# EAGLE design nor (EAGLE 9.6.2)
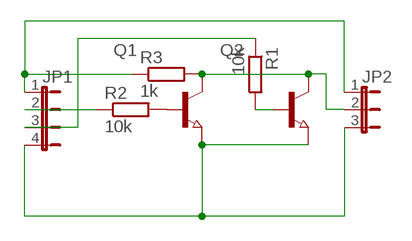
[diagram p0: schematic, sheet 1]

## Parts
JP1  JP4E  [JP4]
JP2  JP2W  [JP2W]
Q1  NPN-TRANSISTOR_SOT23  [SOT23]
Q2  NPN-TRANSISTOR_SOT23  [SOT23]
R1  10k  R-EU_R1206  [R1206]
R2  10k  R-EU_R1206  [R1206]
R3  1k  R-EU_R1206  [R1206]

## Nets
N$1: Q2.1(B) R1.2
N$2: Q1.1(B) R2.2
N$3: JP1.4 JP2.3 Q1.2(E) Q2.2(E)
N$5: JP2.2 Q1.3(C) Q2.3(C) R3.2
N$6: JP1.2 R2.1
N$7: JP1.3 R1.1
N$8: JP1.1 JP2.1 R3.1

## Library data of the parts
JP1 = jumper:JP4E: JUMPER
JP2 = jumper:JP2W: JUMPER
Q1 Q2 = semicon-smd-ipc:NPN-TRANSISTOR_: NPN TRANSISTOR
R1-R3 = rcl:R-EU_: RESISTOR, European symbol; SPICEPREFIX: R

## Net classes
0 default: width 1.27 mm

## Board
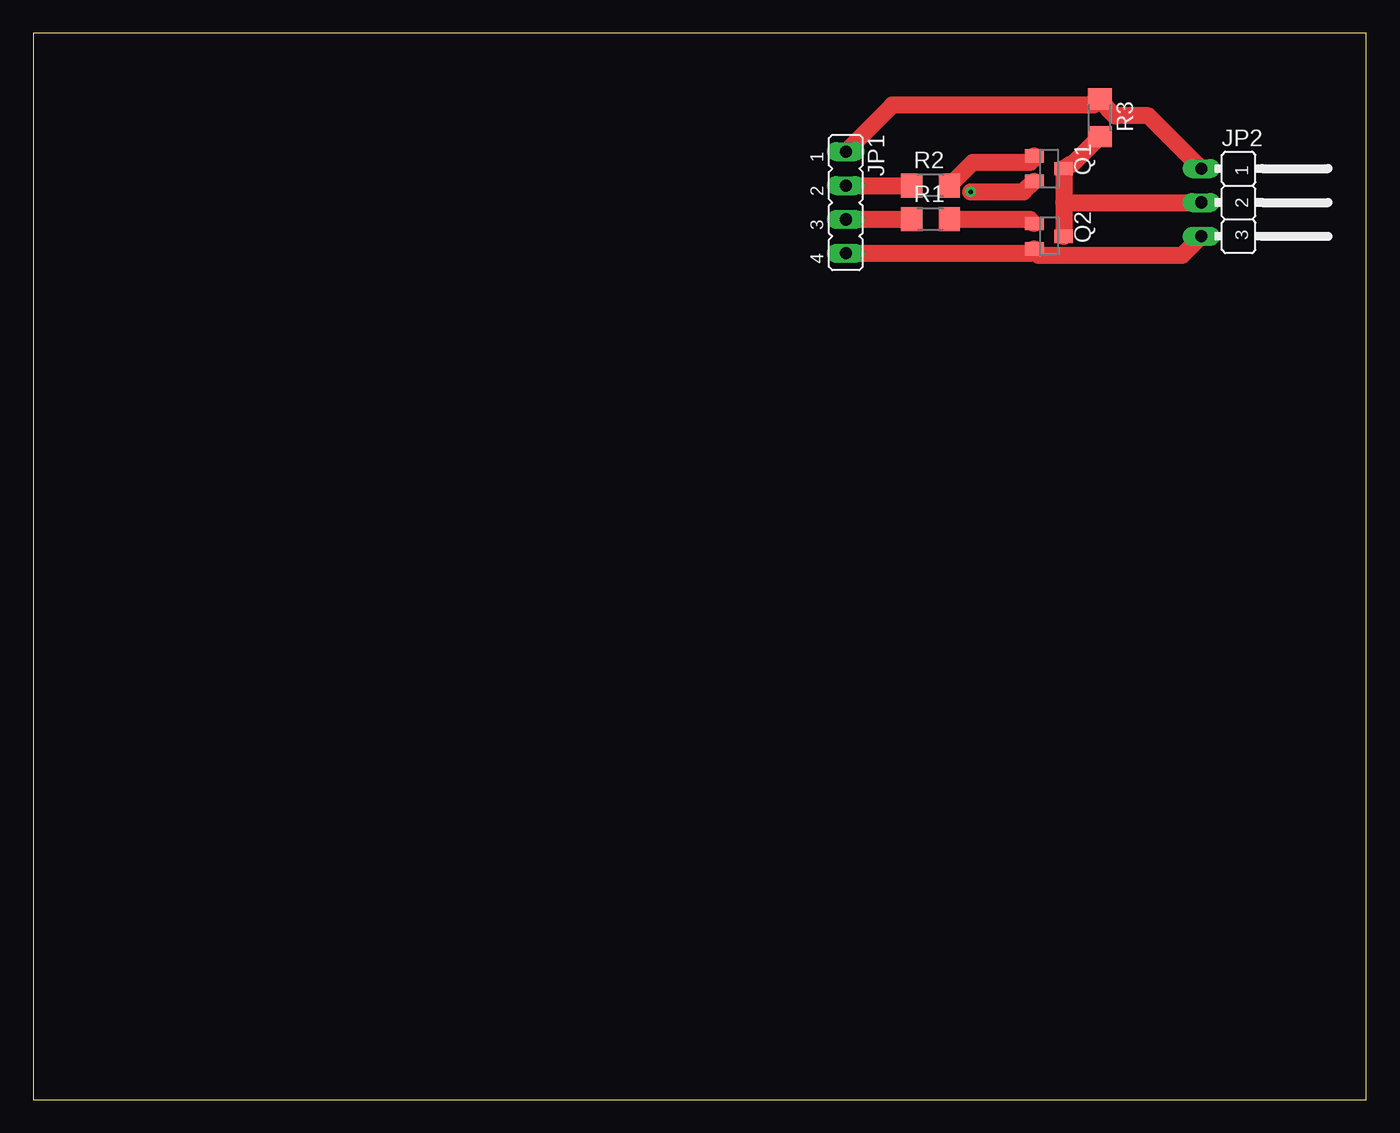
[diagram p1: board, top side]
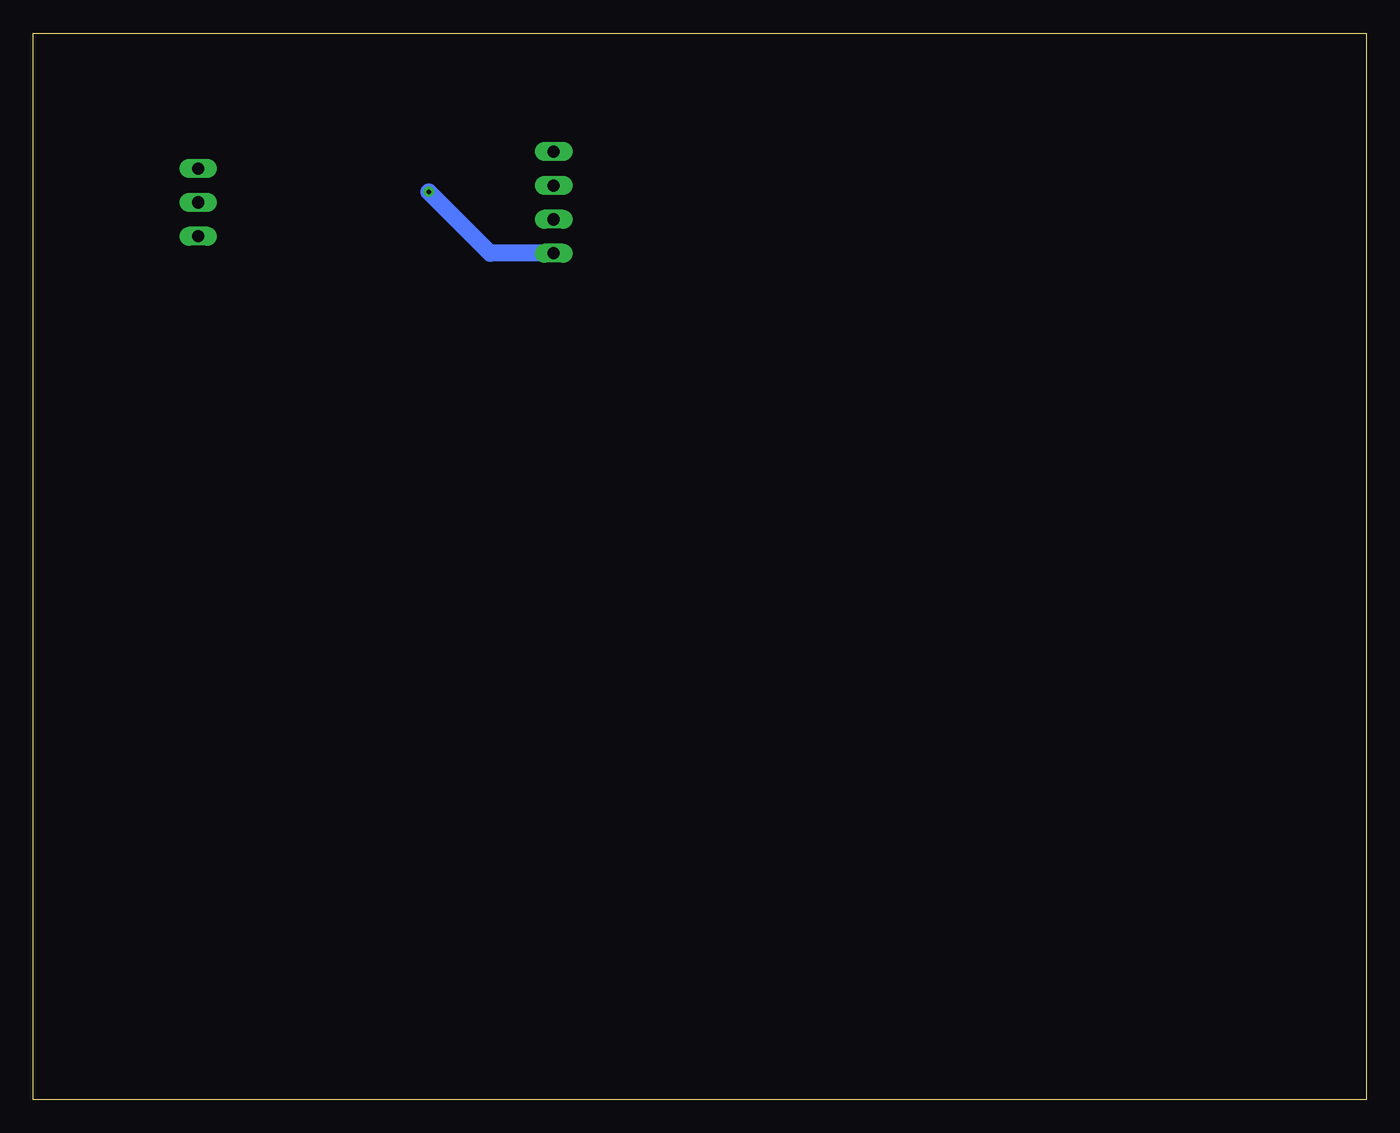
[diagram p2: board, bottom side, seen from below]

Size 100 x 80 mm. Coordinates in mm from the lower left corner, seen from the top.
Outline: 0,0 100,0 100,80 0,80 0,0
Copper layers (1*16): Top 0.035mm / dielectric 1.5mm / Bottom 0.035mm
Design rules "default": minimum track width 6mil, minimum drill 0.35mm, track to track 6mil, track to pad 6mil, pad to pad 6mil, via to via 6mil, smd to smd 6mil, copper to edge 40mil, drill to drill 6mil, minimum pad ring 10mil, minimum via ring 8mil, stop-mask expansion 4mil, vias tented up to drill 0mil, thermal gap 10mil

### Footprints (pad centres in the part's own frame; a part is rotated, then mirrored left to right if it is on the bottom)
JP4 = drill 0.914 long: 1 -3.81,0; 2 -1.27,0; 3 1.27,0; 4 3.81,0
JP2W = drill 0.914 long: 1 -2.54,-1.27; 2 0,-1.27; 3 2.54,-1.27
SOT23 = smd 1 x 1.4: 1 -0.95,-1.1; 2 0.95,-1.1; 3 0,1.1
R1206 = smd 1.6 x 1.803: 1 -1.422,0; 2 1.422,0

### Placement (x,y rotation side)
JP1  60.96,67.31 270 top
JP2  88.9,67.31 270 top
Q1  76.2,69.85 270 top
Q2  76.2,64.77 270 top
R1  67.31,66.04 0 top
R2  67.31,68.58 0 top
R3  80.01,73.66 270 top

### Tracks (layer width: path | path; a pad name or v marks a point on that pad's centre or on a via)
N$1
  Top 1.27: R1.2 74.77,66.04 75.09,65.72 Q2.1
N$2
  Top 1.27: Q1.1 75.09,70.64 74.77,70.33 70.48,70.33 R2.2
N$3  (via drill 0.35)
  Top 1.27: JP1.4 74.77,63.5 75.09,63.82 Q2.2 75.41,63.34 86.2,63.34 JP2.3 | v70.33,68.1 74.3,68.1 75.09,68.9 Q1.2
  Bottom 1.27: v70.33,68.1 65.72,63.5 JP1.4
N$5
  Top 1.27: 77.31,67.31 77.31,69.85 Q1.3 77.79,70.17 77.95,70.17 R3.2 | 77.31,67.31 77.31,64.77 Q2.3 | 77.31,67.31 JP2.2
N$6
  Top 1.27: JP1.2 R2.1
N$7
  Top 1.27: JP1.3 R1.1
N$8
  Top 1.27: JP2.1 83.66,73.82 81.12,73.82 80.01,74.93 R3.1 79.53,74.61 64.45,74.61 JP1.1